# EasyEDA Pro project ProPrj_Bed Temp Regulation_2026-02-19.epro

# Schematic Schematic Main

## Sheets
1 ADC & ESP: Board Name: Main Board; Create Date: 2026-02-11; Page Name: ADC & ESP; Project Name: Bed Temp Regulation; Schematic Name: Schematic Main; Update Date: 2026-02-17; Company: EasyEDA.com; Page Size: A4; Version: V1.0
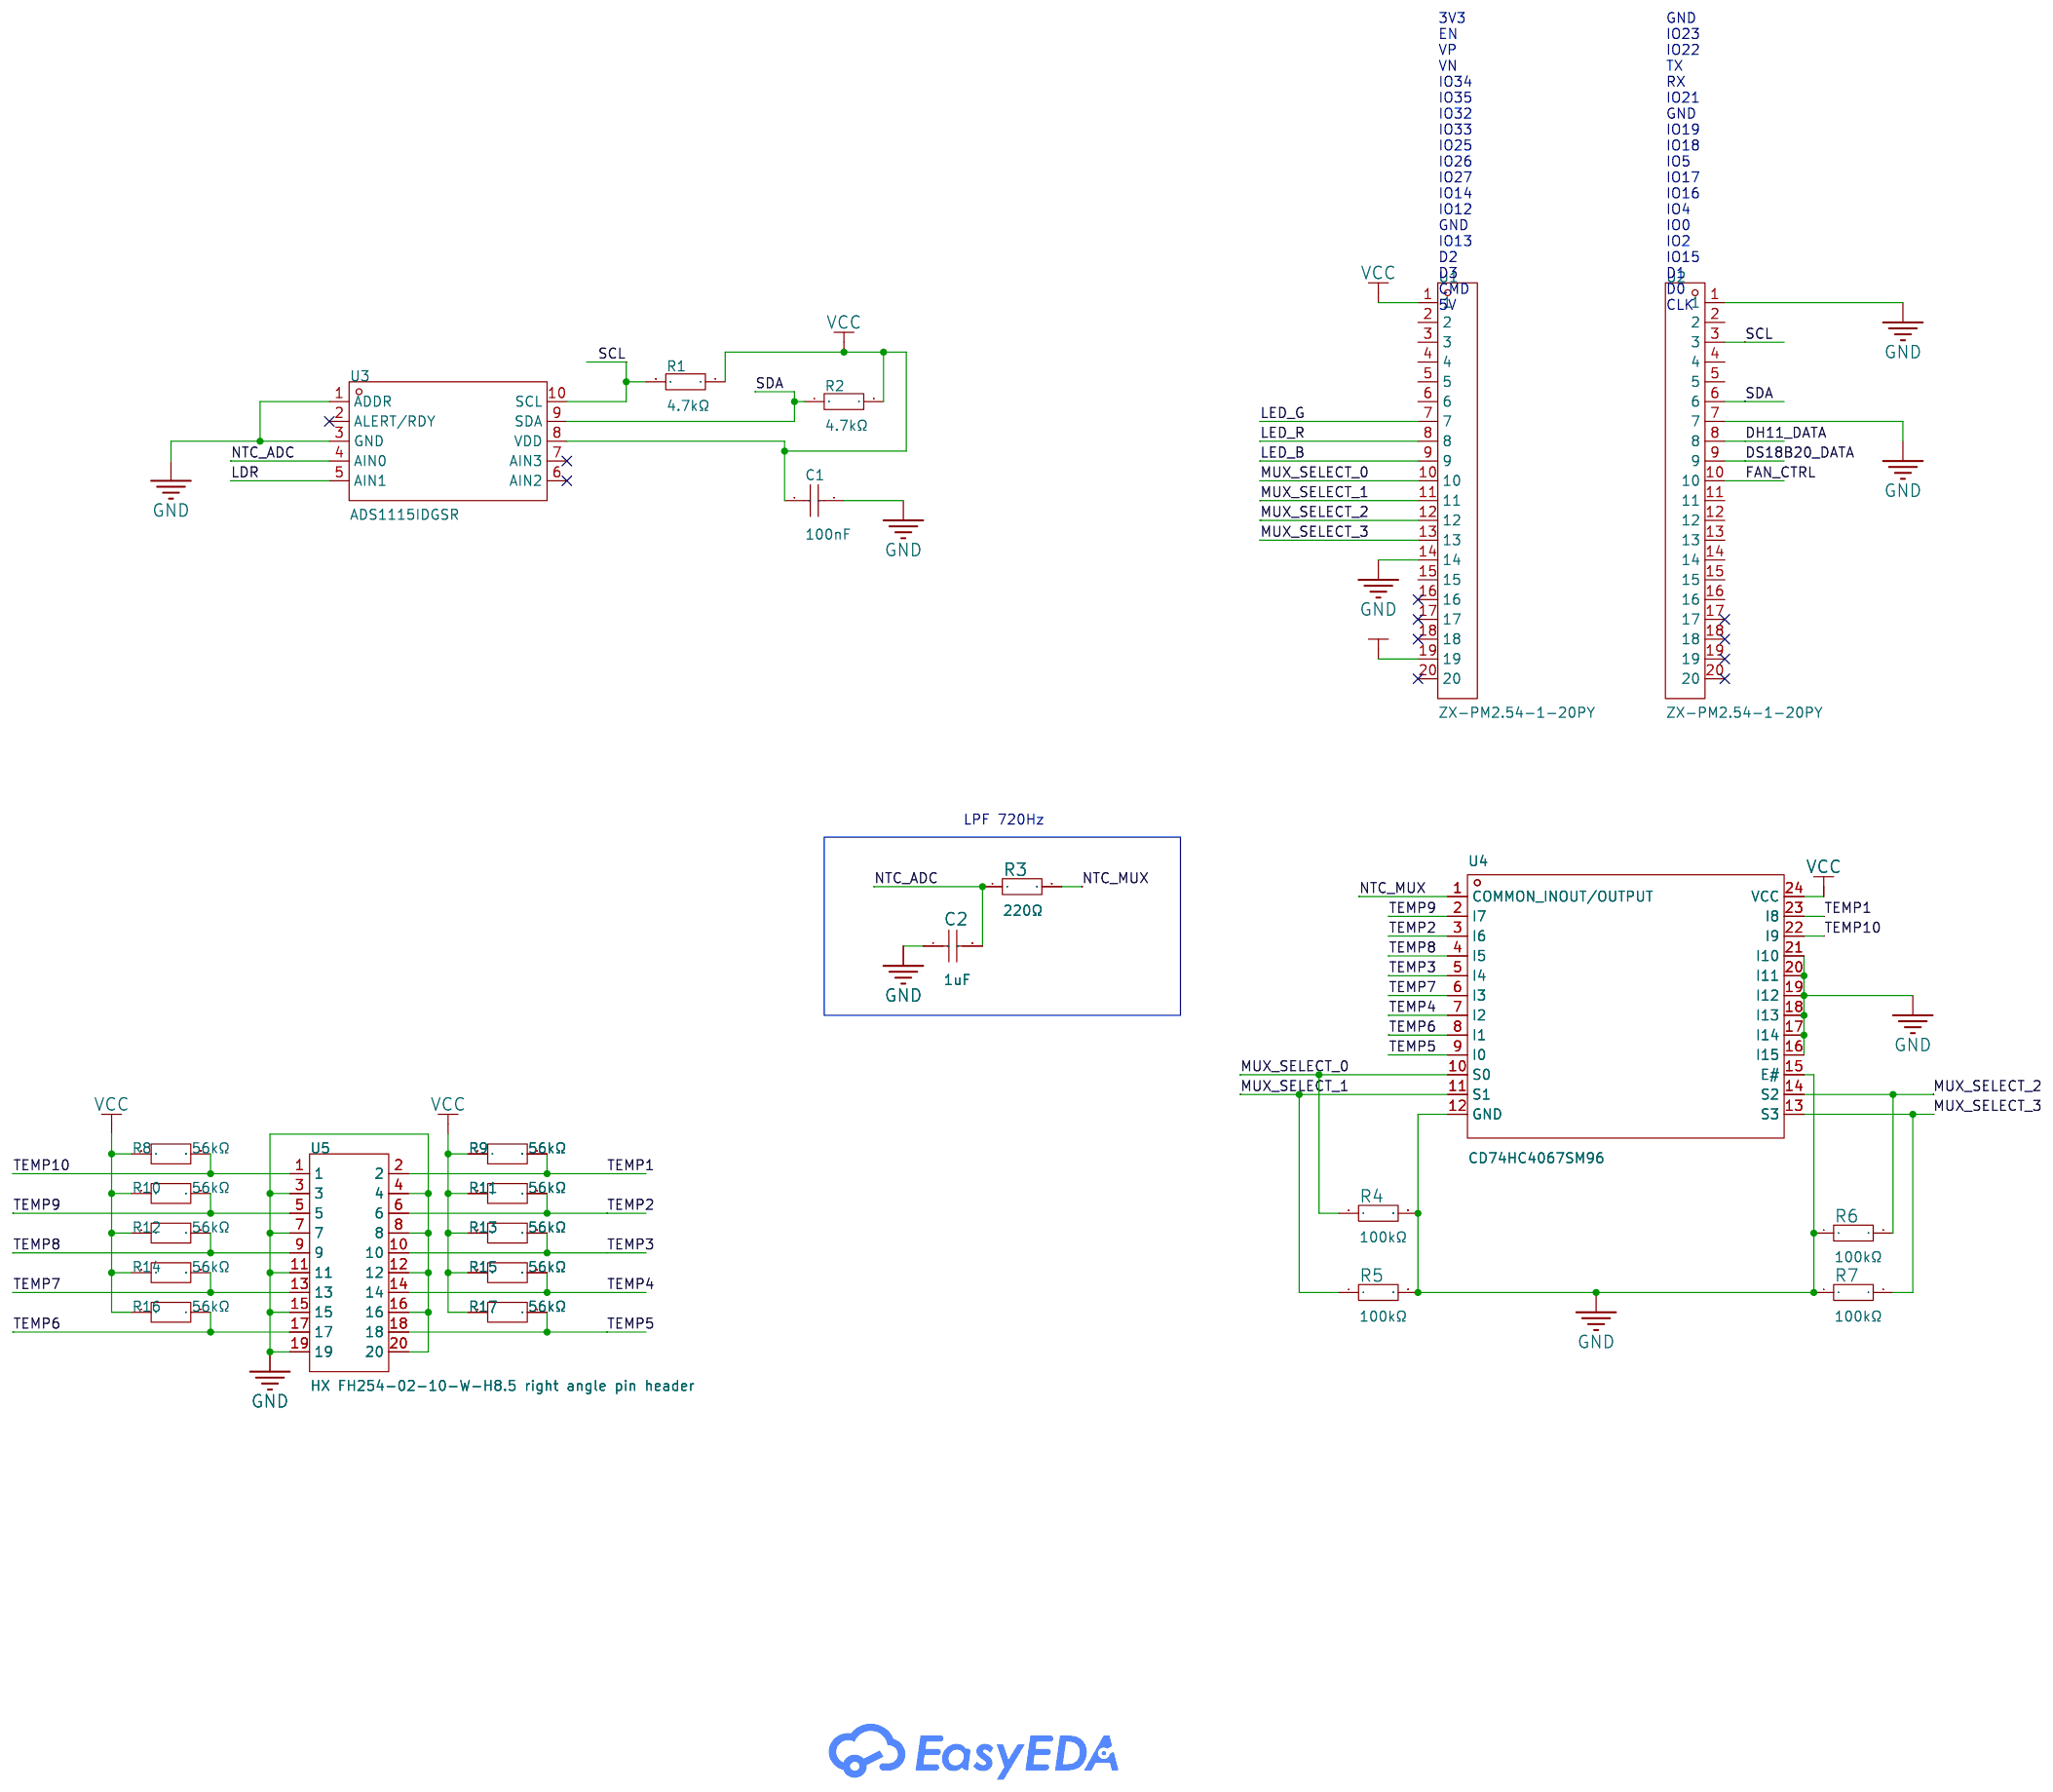
[diagram p0: ADC & ESP]
2 FAN: Create Date: 2026-02-16; Page Name: FAN
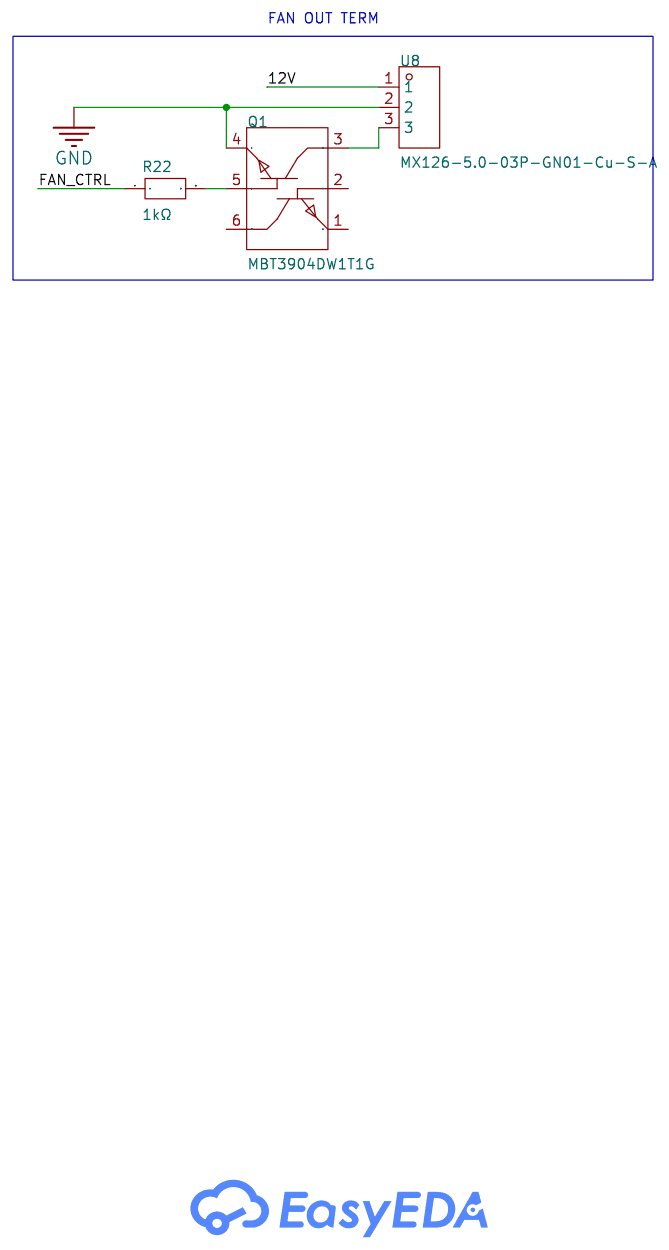
[diagram p1: FAN]
3 PWR: Create Date: 2026-02-16; Page Name: PWR
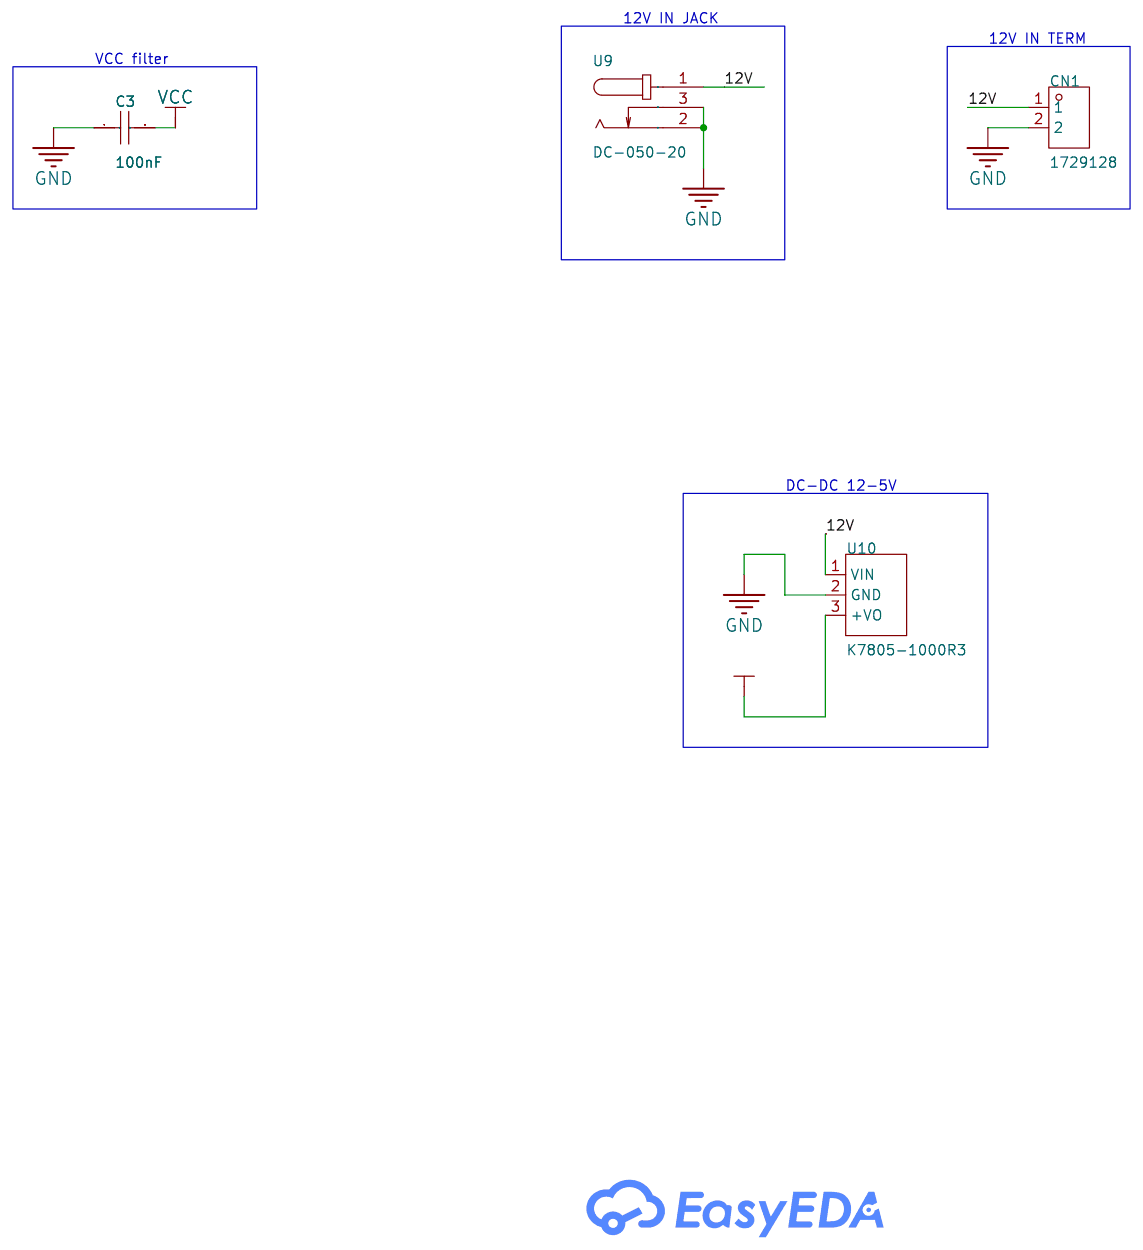
[diagram p2: PWR]
4 LED & ENV: Create Date: 2026-02-16; Page Name: LED & ENV
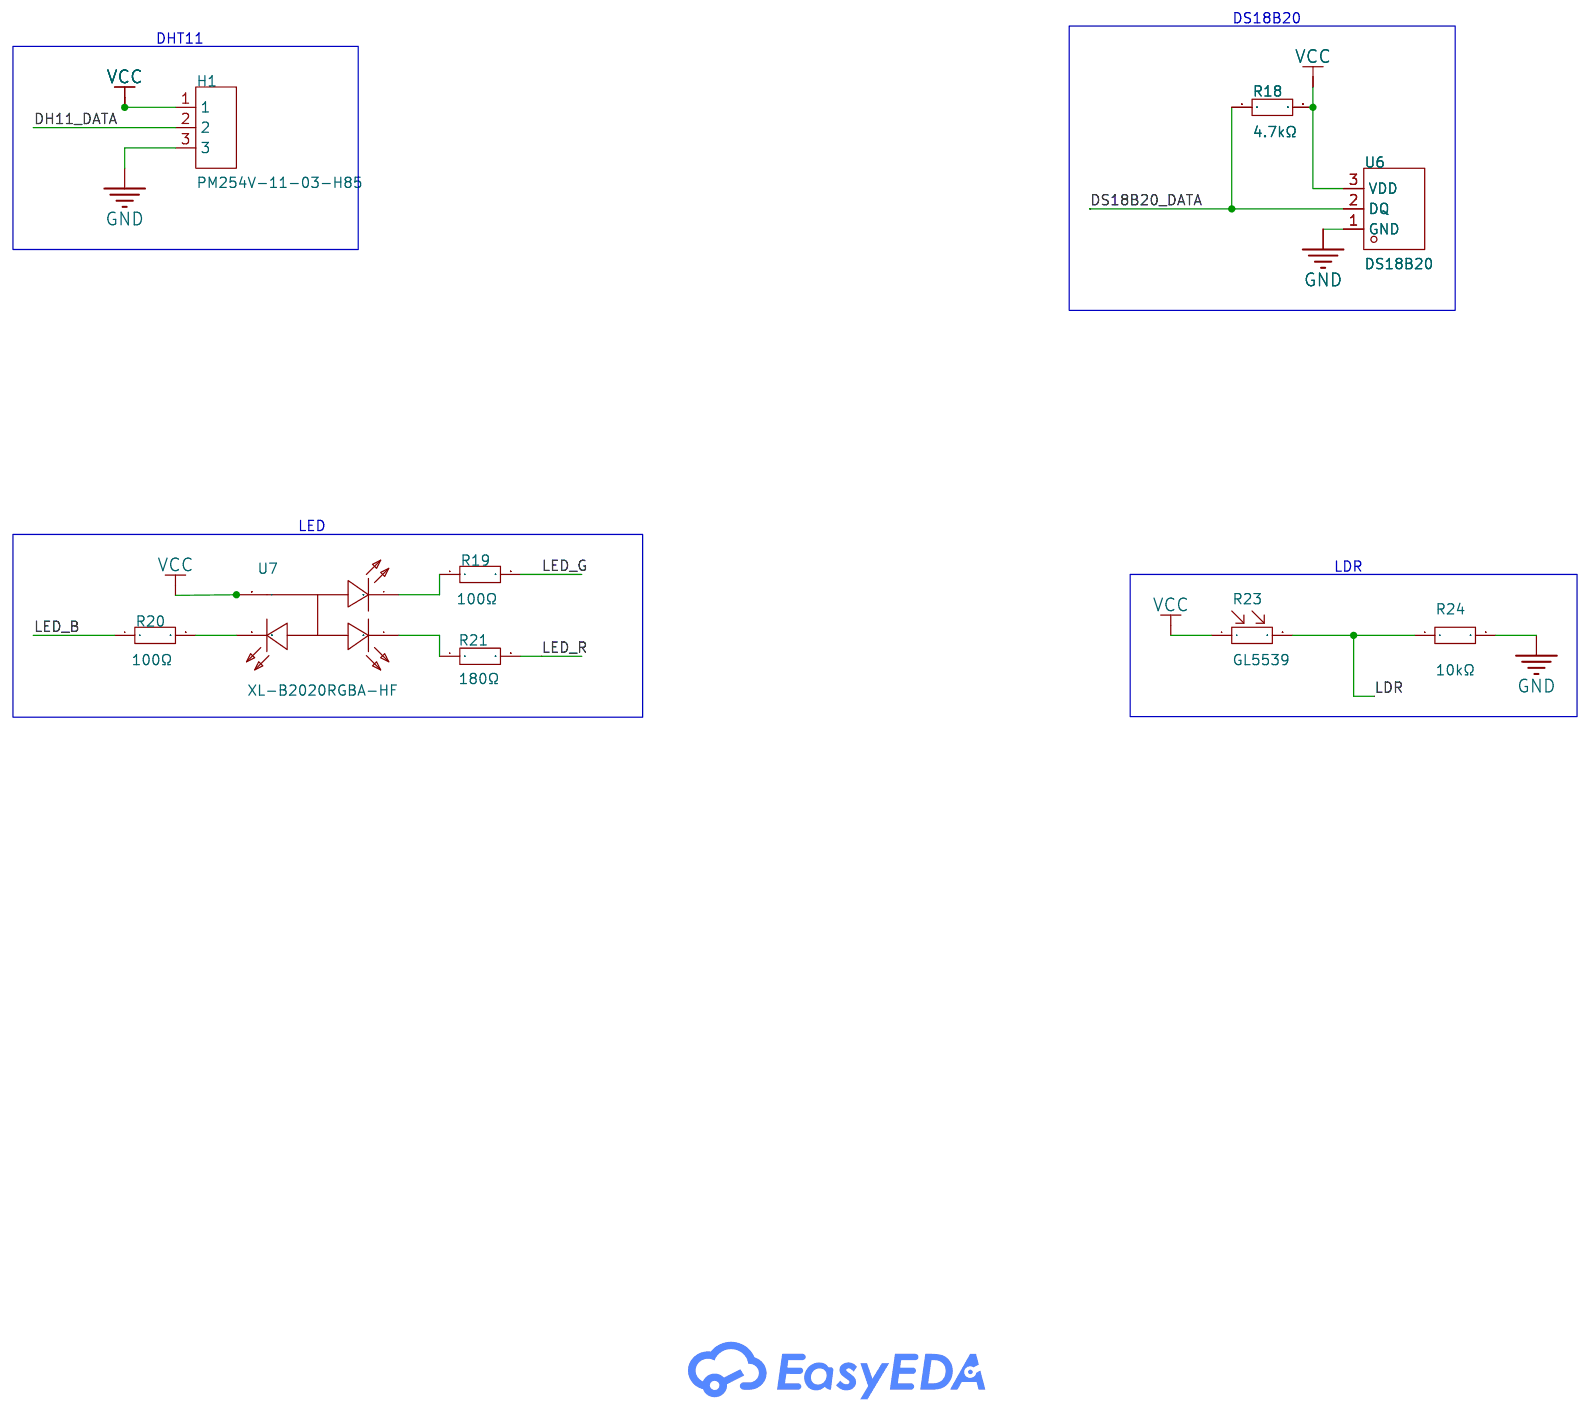
[diagram p3: LED & ENV]

## Parts
sheet ADC & ESP
C1  100nF  [C0805]
C2  1uF  [C0805]
R1  4.7kΩ  [R0805]
R2  4.7kΩ  [R0805]
R3  220Ω  [R0805]
R4  100kΩ  [R0805]
R5  100kΩ  [R0805]
R6  100kΩ  [R0805]
R7  100kΩ  [R0805]
R8  56kΩ  [R0805]
R9  56kΩ  [R0805]
R10  56kΩ  [R0805]
R11  56kΩ  [R0805]
R12  56kΩ  [R0805]
R13  56kΩ  [R0805]
R14  56kΩ  [R0805]
R15  56kΩ  [R0805]
R16  56kΩ  [R0805]
R17  56kΩ  [R0805]
U1  ZX-PM2.54-1-20PY  [HDR-TH_20P-P2.54-V-F]
U2  ZX-PM2.54-1-20PY  [HDR-TH_20P-P2.54-V-F]
U3  ADS1115IDGSR  [MSOP-10_L3.0-W3.0-P0.50-LS5.0-BL]
U4  CD74HC4067SM96  [SSOP-24_L8.1-W5.3-P0.65-LS7.8-BL]
U5  HX FH254-02-10-W-H8.5 right angle pin header  [HDR-TH_20P-P2.54-H-F-R2-C10-S2.54-W12.7]
sheet FAN
Q1  MBT3904DW1T1G  [SOT-363_L2.0-W1.3-P0.65-LS2.1-TL]
R22  1kΩ  [R0805]
U8  MX126-5.0-03P-GN01-Cu-S-A  [CONN-TH_3P-P5.00_MAX_MX126-5.0-GN01-03P-CU-S-A]
sheet LED & ENV
H1  PM254V-11-03-H85  [HDR-TH_3P-P2.54-V-F]
R18  4.7kΩ  [R0805]
R19  100Ω  [R0805]
R20  100Ω  [R0805]
R21  180Ω  [R0805]
R23  GL5539  [RES-TH_L5.1-W4.3-P3.40-D0.5]  (no BOM)
R24  10kΩ  [R0805]
U6  DS18B20  [TO-92-3_L4.5-W3.5-P1.27-L]  (no BOM)
U7  XL-B2020RGBA-HF  [LED-SMD_4P-L2.1-W2.1-P1.0-BL]
sheet PWR
C3  100nF  [C0805]
CN1  1729128  [CONN-TH_2P-P5.08_1729128]
U9  DC-050-20  [DC-IN-SMD_DC-050-20A]
U10  K7805-1000R3  [PWRM-TH_YLPTEC_K78XX-1000R3]

## Library data of the parts
C1 C3 = CL21B104KCFNNNE: Capacitance:100nF Tolerance:±10% Tolerance:±10% Voltage Rating:100V Temperature Coefficient:X7R; LCSC Part Name: 100nF ±10% 100V; Supplier Part: C28233; Manufacturer: SAMSUNG(三星); Supplier Footprint: 0805; JLCPCB Part Class: Basic Part; Datasheet: https://item.szlcsc.com/datasheet/CL21B104KCFNNNE/28983.html; Supplier: LCSC; Tolerance: ±10%; Voltage Rating: 100V; Temperature Coefficient: X7R
C2 = CL21B105KBFNNNE: Capacitance:1uF Tolerance:±10% Tolerance:±10% Voltage Rating:50V Temperature Coefficient:X7R; LCSC Part Name: 1uF ±10% 50V; Supplier Part: C28323; Manufacturer: SAMSUNG(三星); Supplier Footprint: 0805; JLCPCB Part Class: Basic Part; Datasheet: https://item.szlcsc.com/datasheet/CL21B105KBFNNNE/29074.html; Supplier: LCSC; Tolerance: ±10%; Voltage Rating: 50V; Temperature Coefficient: X7R
R1 R2 R18 = 0805W8F4701T5E: Type:Thick Film Resistors Resistance:4.7kΩ Tolerance:±1% Tolerance:±1% Power(Watts): Overload Voltage (Max): Temperature Coefficient:±100ppm/℃ Temperature Coefficient:±100ppm/℃ Operating Temperature Range:-55℃~+155℃ Operating Temperature Range:-55℃~+155℃; LCSC Part Name: 4.7kΩ ±1% 125mW 厚膜电阻; Supplier Part: C17673; Manufacturer: UNI-ROYAL(厚声); Supplier Footprint: 0805; JLCPCB Part Class: Basic Part; Datasheet: https://atta.szlcsc.com/upload/public/pdf/source/20200306/C422600_1E6D84923E4A46A82E41ADD87F860B5C.pdf; Supplier: LCSC; Type: Thick Film Resistors; Tolerance: ±1%; Temperature Coefficient: ±100ppm/℃; Operating Temperature Range: -55℃~+155℃
R3 = 0805W8F2200T5E: Type:Thick Film Resistor Resistance:220Ω Tolerance:±1% Tolerance:±1% Power(Watts):125mW Voltage-Supply(Max):150V Temperature Coefficient:±100ppm/℃ Temperature Coefficient:±100ppm/℃ Operating Temperature:-55℃~+155℃ Operating Temperature:-55℃~+155℃; LCSC Part Name: 220Ω ±1% 125mW 厚膜电阻; Supplier Part: C17557; Manufacturer: UNI-ROYAL(厚声); Supplier Footprint: 0805; JLCPCB Part Class: Basic Part; Datasheet: https://item.szlcsc.com/datasheet/0805W8F2200T5E/18245.html; Supplier: LCSC; Type: Thick Film Resistor; Tolerance: ±1%; Power(Watts): 125mW; Voltage-Supply(Max): 150V; Temperature Coefficient: ±100ppm/℃; Operating Temperature: -55℃~+155℃
R4-R7 = 0805W8F1003T5E: Type:Thick Film Resistor Resistance:100kΩ Tolerance:±1% Tolerance:±1% Power(Watts):125mW Voltage-Supply(Max):150V Temperature Coefficient:±100ppm/℃ Temperature Coefficient:±100ppm/℃ Operating Temperature:-55℃~+155℃ Operating Temperature:-55℃~+155℃; LCSC Part Name: 100kΩ ±1% 125mW 厚膜电阻; Supplier Part: C149504; Manufacturer: UNI-ROYAL(厚声); Supplier Footprint: 0805; JLCPCB Part Class: Basic Part; Datasheet: https://item.szlcsc.com/datasheet/0805W8F1003T5E/160838.html; Supplier: LCSC; Type: Thick Film Resistor; Tolerance: ±1%; Power(Watts): 125mW; Voltage-Supply(Max): 150V; Temperature Coefficient: ±100ppm/℃; Operating Temperature: -55℃~+155℃
R8-R17 = TC0525B5602T5G: Type:Thin Film Resistor Resistance:56kΩ Tolerance:±0.1% Tolerance:±0.1% Power(Watts):125mW Voltage-Supply(Max):150V Temperature Coefficient:±25ppm/℃ Temperature Coefficient:±25ppm/℃ Operating Temperature:-55℃~+155℃ Operating Temperature:-55℃~+155℃; LCSC Part Name: 薄膜电阻 56kΩ ±0.1% 125mW; Supplier Part: C21571499; Manufacturer: UNI-ROYAL(厚声); Supplier Footprint: 0805; JLCPCB Part Class: Extended Part; Datasheet: https://item.szlcsc.com/datasheet/TC0525B5602T5G/22998160.html; Supplier: LCSC; Type: Thin Film Resistor; Tolerance: ±0.1%; Power(Watts): 125mW; Voltage-Supply(Max): 150V; Temperature Coefficient: ±25ppm/℃; Operating Temperature: -55℃~+155℃
U1 U2 = ZX-PM2.54-1-20PY: Holes Structure:1x20P Pitch:2.54mm Row Spacing:- Circular Hole / Square Hole:Square Hole Mounting Type:Through Hole Number of Rows:1 Number of Positions:20P Current Rating:3A Voltage Rating (Max):- Holes Direction:Top Insulation Height:8.5mm Contact Mater; LCSC Part Name: 1x20P 间距:2.54mm 直插; Supplier Part: C7499336; Manufacturer: Megastar(兆星); Supplier Footprint: 插件,P=2.54mm; JLCPCB Part Class: Extended Part; Datasheet: https://item.szlcsc.com/datasheet/ZX-PM2.54-1-20PY/8573997.html; Supplier: LCSC; Holes Structure: 1x20P; Pitch: 2.54mm; Circular Hole / Square Hole: Square Hole; Mounting Type: Through Hole; Number of Rows: 1; Number of Positions: 20P; Current Rating: 3A; Holes Direction: Top; Insulation Height: 8.5mm; Contact Material: Brass; Contact Plating: Gold; Operating Temperature: -40℃~+105℃; PIN Length: 3.2mm
U3 = ADS1115IDGSR: Resolution(Bits):16 Sampling Rate:- number of channels:2 Voltage - Supply:2V~5.5V Voltage - Supply:2V~5.5V Interface:I2C differential input:Yes Integral non - linearity:1LSB Integral non - linearity:1LSB Operating Temperature:-40℃~+125℃ Operating Temperat; LCSC Part Name: 具有内部基准、振荡器和可编程比较器且兼容 I2C 的ADS111x、超小型、低功耗 860SPS、16位ADC; Supplier Part: C37593; Manufacturer: TI(德州仪器); Supplier Footprint: VSSOP-10; JLCPCB Part Class: Extended Part; Datasheet: https://www.ti.com/cn/lit/gpn/ads1115; Supplier: LCSC; Resolution(Bits): 16; number of channels: 2; Voltage - Supply: 2V~5.5V; Interface: I2C; differential input: Yes; Integral non - linearity: 1LSB; Operating Temperature: -40℃~+125℃; Clock/Oscillator: Built-in; Voltage Reference: Built-in; Programmable Gain: Support; ADC architecture: Sigma-Delta; Data rate: 128Hz；8Hz；64Hz；16Hz；32Hz；250Hz；475Hz；860Hz; Quiescent Current (Iq): 500nA; Full-Scale Range(FSR): 2.048V
U4 = CD74HC4067SM96: Switch Circuit:16:1 Number of Channels:16 Voltage - Supply:2V~6V Voltage - Supply:2V~6V Turn-on time:- Ron:70Ω Turn-off time:- Operating Temperature:-55℃~+125℃ Operating Temperature:-55℃~+125℃ Con:5pF Bandwidth:89MHz Propagation Delay (tpd):15ns; LCSC Part Name: 高速CMOS逻辑16通道模拟多路复用器/解复用器; Supplier Part: C98457; Manufacturer: TI(德州仪器); Supplier Footprint: SSOP-24-208mil; JLCPCB Part Class: Extended Part; Datasheet: https://www.ti.com/cn/lit/gpn/cd74hc4067; Supplier: LCSC; Switch Circuit: 16:1; Number of Channels: 16; Voltage - Supply: 2V~6V; Ron: 70Ω; Operating Temperature: -55℃~+125℃; Con: 5pF; Bandwidth: 89MHz; Propagation Delay (tpd): 15ns
U5 = HX FH254-02-10-W-H8.5 right angle pin header: Holes Structure:2x10P Pitch:2.54mm Row Spacing:2.54mm Circular Hole / Square Hole:Square Hole Mounting Type:Right Angle Number of Rows:2 Number of Positions:20P Current Rating:3A Voltage Rating (Max):1kV Holes Direction:Side Insulation Height:8.5mm Contac; LCSC Part Name: 2x10P 间距:2.54mm 弯插; Supplier Part: C52016398; Manufacturer: hanxia(韩下); Supplier Footprint: 弯插,P=2.54mm; JLCPCB Part Class: Extended Part; Datasheet: https://item.szlcsc.com/datasheet/HX%2520FH254-02-10-W-H8.5%2520right%2520angle%2520pin%2520header/54760443.html; Supplier: LCSC; Holes Structure: 2x10P; Pitch: 2.54mm; Row Spacing: 2.54mm; Circular Hole / Square Hole: Square Hole; Mounting Type: Right Angle; Number of Rows: 2; Number of Positions: 20P; Current Rating: 3A; Voltage Rating (Max): 1kV; Holes Direction: Side; Insulation Height: 8.5mm; Contact Material: Brass; Contact Plating: Gold; Operating Temperature: -40℃~+105℃; PIN Length: 3.2mm
Q1 = MBT3904DW1T1G: type:NPN Current - Collector(Ic):200mA Collector - Emitter Voltage VCEO:40V Pd - Power Dissipation:150mW DC Current Gain:100@10mA,1.0V DC Current Gain:100@10mA,1.0V Transition frequency(fT):300MHz Current - Collector Cutoff:50nA Vce Saturation(VCE(sat)):3; LCSC Part Name: NPN 电流:200mA 电压:40V; Supplier Part: C110150; Manufacturer: onsemi(安森美); Supplier Footprint: SOT-363; JLCPCB Part Class: Extended Part; Datasheet: https://item.szlcsc.com/datasheet/MBT3904DW1T1G/111371.html; Supplier: LCSC; type: NPN; Current - Collector(Ic): 200mA; Collector - Emitter Voltage VCEO: 40V; Pd - Power Dissipation: 150mW; DC Current Gain: 100@10mA,1.0V; Transition frequency(fT): 300MHz; Current - Collector Cutoff: 50nA; Vce Saturation(VCE(sat)): 300mV@50mA,5mA; Operating Temperature: -55℃~+150℃; Emitter-Base Voltage(Vebo): 6V
R22 = FRC0805J102 TS: Type:Thick Film Resistor Resistance:1kΩ Tolerance:±5% Tolerance:±5% Power(Watts):125mW Voltage-Supply(Max):150V Temperature Coefficient:±100ppm/℃ Temperature Coefficient:±100ppm/℃ Operating Temperature:-55℃~+155℃ Operating Temperature:-55℃~+155℃; LCSC Part Name: 1kΩ ±5% 125mW 厚膜电阻; Supplier Part: C2907295; Manufacturer: FOJAN(富捷); Supplier Footprint: 0805; JLCPCB Part Class: Extended Part; Supplier: LCSC; Type: Thick Film Resistor; Tolerance: ±5%; Power(Watts): 125mW; Voltage-Supply(Max): 150V; Temperature Coefficient: ±100ppm/℃; Operating Temperature: -55℃~+155℃
U8 = MX126-5.0-03P-GN01-Cu-S-A: Number of Positions or Pins:1x3P Pitch:5mm Color:Green Mounting Type:Through Hole Number of Pins:3P Number of Rows:1 Number of PINs Per Row:3 Screw Specification:M2.5 Current Rating:10A Voltage Rating (Max):300V Wire Gauge - AWG:14~26 Wire Gauge - mm2:2.5; LCSC Part Name: 1x3P 5mm 直插 排数:1 每排P数:3; Supplier Part: C5188435; Manufacturer: MAX(迈旭); Supplier Footprint: 插件,P=5mm; JLCPCB Part Class: Extended Part; Datasheet: https://item.szlcsc.com/datasheet/MX126-5.0-03P-GN01-Cu-S-A/5862519.html; Supplier: LCSC; Number of Positions or Pins: 1x3P; Pitch: 5mm; Color: Green; Mounting Type: Through Hole; Number of Pins: 3P; Number of Rows: 1; Number of PINs Per Row: 3; Screw Specification: M2.5; Current Rating: 10A; Voltage Rating (Max): 300V; Wire Gauge - AWG: 14~26; Wire Gauge - mm2: 2.5; Operating Temperature: -40℃~+105℃
H1 = PM254V-11-03-H85: Holes Structure:1x3P Pitch:2.54mm Row Spacing:- Circular Hole / Square Hole:Square Hole Mounting Type:Through Hole Number of Rows:1 Number of Positions:3P Current Rating:3A Holes Direction:Top Insulation Height:8.5mm Contact Material:Brass Contact Plating; LCSC Part Name: 1x3P 间距:2.54mm 直插; Supplier Part: C541850; Manufacturer: XFCN(兴飞); Supplier Footprint: 插件,P=2.54mm; JLCPCB Part Class: Extended Part; Datasheet: https://item.szlcsc.com/datasheet/PM254V-11-03-H85/562471.html; Supplier: LCSC; Holes Structure: 1x3P; Pitch: 2.54mm; Circular Hole / Square Hole: Square Hole; Mounting Type: Through Hole; Number of Rows: 1; Number of Positions: 3P; Current Rating: 3A; Holes Direction: Top; Insulation Height: 8.5mm; Contact Material: Brass; Operating Temperature: -40℃~+105℃
R19 R20 = 0805W8F1000T5E_C17408: Type:Thick Film Resistors Resistance: Tolerance:±1% Tolerance:±1% Power(Watts): Overload Voltage (Max): Temperature Coefficient:±100ppm/℃ Temperature Coefficient:±100ppm/℃ Operating Temperature Range:-55℃~+155℃ Operating Temperature Range:-55℃~+155℃; LCSC Part Name: 100Ω ±1% 125mW 厚膜电阻; Supplier Part: C17408; Manufacturer: UNI-ROYAL(厚声); Manufacturer Part: 0805W8F1000T5E; Supplier Footprint: 0805; JLCPCB Part Class: Basic Part; Datasheet: https://atta.szlcsc.com/upload/public/pdf/source/20200306/C422600_1E6D84923E4A46A82E41ADD87F860B5C.pdf; Supplier: LCSC; Type: Thick Film Resistors; Tolerance: ±1%; Temperature Coefficient: ±100ppm/℃; Operating Temperature Range: -55℃~+155℃
R21 = 0805W8F1800T5E: Type:Thick Film Resistor Resistance:180Ω Tolerance:±1% Tolerance:±1% Power(Watts):125mW Voltage-Supply(Max):150V Temperature Coefficient:±100ppm/℃ Temperature Coefficient:±100ppm/℃ Operating Temperature:-55℃~+155℃ Operating Temperature:-55℃~+155℃; LCSC Part Name: 180Ω ±1% 125mW 厚膜电阻; Supplier Part: C25270; Manufacturer: UNI-ROYAL(厚声); Supplier Footprint: 0805; JLCPCB Part Class: Extended Part; Datasheet: https://item.szlcsc.com/datasheet/0805W8F1800T5E/26013.html; Supplier: LCSC; Type: Thick Film Resistor; Tolerance: ±1%; Power(Watts): 125mW; Voltage-Supply(Max): 150V; Temperature Coefficient: ±100ppm/℃; Operating Temperature: -55℃~+155℃
R23 = GL5539: Dark Resistance:10MΩ Cell Resistance @ Illuminance:50kΩ~100kΩ Cell Resistance @ Illuminance:50kΩ~100kΩ Voltage - Max:150V Wavelength - Peak:540nm Rise Time:20ms Fall Time:30ms Operating Temperature:-30℃~+70℃ Operating Temperature:-30℃~+70℃ γ Value:0.8; Supplier Part: C125630; Manufacturer: 森霸; Supplier Footprint: 插件,P=3mm; JLCPCB Part Class: Extended Part; Datasheet: https://item.szlcsc.com/datasheet/GL5539/136908.html; Supplier: LCSC; Dark Resistance: 10MΩ; Cell Resistance @ Illuminance: 50kΩ~100kΩ; Voltage - Max: 150V; Wavelength - Peak: 540nm; Rise Time: 20ms; Fall Time: 30ms; Operating Temperature: -30℃~+70℃; γ Value: 0.8
R24 = 0805W8F1002T5E: Type:Thick Film Resistor Resistance:10kΩ Tolerance:±1% Tolerance:±1% Power(Watts):125mW Voltage-Supply(Max):150V Temperature Coefficient:±100ppm/℃ Temperature Coefficient:±100ppm/℃ Operating Temperature:-55℃~+155℃ Operating Temperature:-55℃~+155℃; LCSC Part Name: 10kΩ ±1% 125mW 厚膜电阻; Supplier Part: C17414; Manufacturer: UNI-ROYAL(厚声); Supplier Footprint: 0805; JLCPCB Part Class: Basic Part; Datasheet: https://item.szlcsc.com/datasheet/0805W8F1002T5E/18102.html; Supplier: LCSC; Type: Thick Film Resistor; Tolerance: ±1%; Power(Watts): 125mW; Voltage-Supply(Max): 150V; Temperature Coefficient: ±100ppm/℃; Operating Temperature: -55℃~+155℃
U6 = DS18B20: Temperature Range:- Temperature Range:- Tolerance:±0.4℃ Tolerance:±0.4℃ Voltage - Supply:2.5V~5.5V Voltage - Supply:2.5V~5.5V Standby Current:- Interface:- Temperature Conversion Time:- Temperature Resolution:-; LCSC Part Name: 温度-10℃~70℃ 精度±0.4℃ 电压2.5V~5.5V; Supplier Part: C5451632; Manufacturer: HXY MOSFET(华轩阳电子); Supplier Footprint: TO-92; JLCPCB Part Class: Extended Part; Datasheet: https://item.szlcsc.com/datasheet/DS18B20/6355375.html; Supplier: LCSC; Tolerance: ±0.4℃; Voltage - Supply: 2.5V~5.5V
U7 = XL-B2020RGBA-HF: Diode Configuration:Common Anode Wavelength - Dominant:B:460nm~470nm；G:520nm~530nm；R:620nm~630nm Peak Wavelength:G:520nm；R:625nm；B:465nm Luminous Intensity:G:240mcd~780mcd；R:55mcd~280mcd；B:75mcd~380mcd Viewing Angle:120° Forward Current:R:20mA；B:20mA；G:20; LCSC Part Name: 发光二极管 高亮度七彩 封装：2020黑色哑光 功率 50mW；70mW；70mW 正向电流 20mA 主波长 620nm~630nm；520~530nm；460~470nm 峰值波长 625nm; 520nm; 465nm 工作温度 -20℃~+85℃; Supplier Part: C22461782; Manufacturer: XINGLIGHT(成兴光); Supplier Footprint: SMD-4P,2.1x2.1mm; JLCPCB Part Class: Extended Part; Datasheet: https://item.szlcsc.com/datasheet/XL-B2020RGBA-HF/24144332.html; Supplier: LCSC; Diode Configuration: Common Anode; Wavelength - Dominant: B:460nm~470nm；G:520nm~530nm；R:620nm~630nm; Peak Wavelength: G:520nm；R:625nm；B:465nm; Luminous Intensity: G:240mcd~780mcd；R:55mcd~280mcd；B:75mcd~380mcd; Viewing Angle: 120°; Forward Current: R:20mA；B:20mA；G:20mA; Forward Voltage(Vf): G:2.6V~3.2V；R:1.9V~2.3V；B:2.6V~3.2V; Antistatic Capacity: B:2000V；R:2000V；G:2000V; Power(Watts): G:70mW；B:70mW；R:50mW; Operating Temperature: -20℃~+85℃; Length: 2.1mm; Width: 2.1mm; Height: 1mm
CN1 = 1729128_C7509570: LCSC Part Name: 可拼接 1729128; Supplier Part: C7509570; Manufacturer: Phoenix Contact(菲尼克斯); Supplier Footprint: 插件,P=5.08mm; JLCPCB Part Class: Extended Part; Datasheet: https://item.szlcsc.com/datasheet/1729128/8618709.html; Supplier: LCSC
U9 = DC-050-20: Connector Type:DC Power Jack Mounting Type:Surface Mount, Right Angle Inside Contact Diameter:2mm Outside Contact Diameter:6mm; LCSC Part Name: DC电源插座 内径:2mm 外径:6mm; Supplier Part: C22435680; Manufacturer: HanElectricity(瀚源); Supplier Footprint: SMD; JLCPCB Part Class: Extended Part; Datasheet: https://item.szlcsc.com/datasheet/DC-050-20/24065954.html; Supplier: LCSC; Connector Type: DC Power Jack; Mounting Type: Surface Mount, Right Angle; Inside Contact Diameter: 2mm; Outside Contact Diameter: 6mm
U10 = K7805-1000R3: Function:Buck-Boost Number of Outputs:1 Voltage - Supply:8V~36V Voltage - Supply:8V~36V Output Voltage Accuracy:±3% Output Voltage Accuracy:±3% Output Voltage:5V Output Voltage:5V Output Current(Max):1A Output Current(Max):1A Output Power:- Conversion Eff; LCSC Part Name: DC/DC电源模块-非隔离; Supplier Part: C2992391; Manufacturer: YLPTEC(易川); Supplier Footprint: DIP,11.5x7.6mm; JLCPCB Part Class: Extended Part; Datasheet: https://item.szlcsc.com/datasheet/K7805-1000R3/3456894.html; Supplier: LCSC; Function: Buck-Boost; Number of Outputs: 1; Voltage - Supply: 8V~36V; Output Voltage Accuracy: ±3%; Output Voltage: 5V; Output Current(Max): 1A; Conversion Efficiency: 93%; Capacitive Load(Max): 680uF; Supply Current (Iq): 1mA; Switching Frequency: 500kHz; Ripple Noise: 60mVp-p; Features: Short Circuit Protection; Length: 11.5mm; Width: 7.55mm; Height: 10.2mm; Operating Temperature Range: -40℃~+85℃

## Nets
5V: U1.19 U10.3(+VO)
12V: CN1.1 U8.1 U9.1 U10.1(VIN)
GND: C1.1 C2.1 C3.1 CN1.2 H1.3 Q1.4 R4.2 R5.2 R6.1 R7.1 R24.2 U1.14 U2.1 U2.7 U3.1(ADDR) U3.3(GND) U4.12(GND) U4.15(E#) U4.16(I15) U4.17(I14) U4.18(I13) U4.19(I12) U4.20(I11) U4.21(I10) U5.3 U5.4 U5.7 U5.8 U5.11 U5.12 U5.15 U5.16 U5.19 U5.20 U6.1(GND) U8.2 U9.2 U9.3 U10.2(GND)
VCC: C1.2 C3.2 H1.1 R1.1 R2.2 R8.1 R9.1 R10.1 R11.1 R12.1 R13.1 R14.1 R15.1 R16.1 R17.1 R18.2 R23.1 U1.1 U3.8(VDD) U4.24(VCC) U6.3(VDD) U7.3(A)
DH11_DATA: H1.2 U2.8
DS18B20_DATA: R18.1 U2.9 U6.2(DQ)
FAN_CTRL: R22.1 U2.10
LDR: R23.2 R24.1 U3.5(AIN1)
LED_B: R20.1 U1.9
LED_G: R19.2 U1.7
LED_R: R21.2 U1.8
MUX_SELECT_0: R4.1 U1.10 U4.10(S0)
MUX_SELECT_1: R5.1 U1.11 U4.11(S1)
MUX_SELECT_2: R6.2 U1.12 U4.14(S2)
MUX_SELECT_3: R7.2 U1.13 U4.13(S3)
NTC_ADC: C2.2 R3.1 U3.4(AIN0)
NTC_MUX: R3.2 U4.1(COMMON INOUT/OUTPUT)
SCL: R1.2 U2.3 U3.10(SCL)
SDA: R2.1 U2.6 U3.9(SDA)
TEMP1: R9.2 U4.23(I8) U5.2
TEMP2: R11.2 U4.3(I6) U5.6
TEMP3: R13.2 U4.5(I4) U5.10
TEMP4: R15.2 U4.7(I2) U5.14
TEMP5: R17.2 U4.9(I0) U5.18
TEMP6: R16.2 U4.8(I1) U5.17
TEMP7: R14.2 U4.6(I3) U5.13
TEMP8: R12.2 U4.4(I5) U5.9
TEMP9: R10.2 U4.2(I7) U5.5
TEMP10: R8.2 U4.22(I9) U5.1
$3N394: Q1.3 U8.3
$3N812: Q1.5 R22.2
$6N1989: R19.1 U7.4(C)
$6N2479: R21.1 U7.1(C)
$6N2851: R20.2 U7.2(C)

Not connected (* = marked no-connect by the designer): Q1 1 2 6; U1 2 3 4 5 6 15 16* 17* 18* 20*; U2 2 4 5 11 12 13 14 15 16 17* 18* 19* 20*; U3 2(ALERT/RDY)* 6(AIN2)* 7(AIN3)*

## Notes on the sheets
sheet 1
- 3V3
  EN
  VP
  VN
  IO34
  IO35
  IO32
  IO33
  IO25
  IO26
  IO27
  IO14
  IO12
  GND
  IO13
  D2
  D3
  CMD
  5V
- GND
  IO23
  IO22
  TX
  RX
  IO21
  GND
  IO19
  IO18
  IO5
  IO17
  IO16
  IO4
  IO0
  IO2
  IO15
  D1
  D0
  CLK
- LPF 720Hz
sheet 2
- FAN OUT TERM
sheet 3
- 12V IN JACK
- 12V IN TERM
- VCC filter
- DC-DC 12-5V
sheet 4
- DS18B20
- DHT11
- LED
- LDR

# Board PCB1
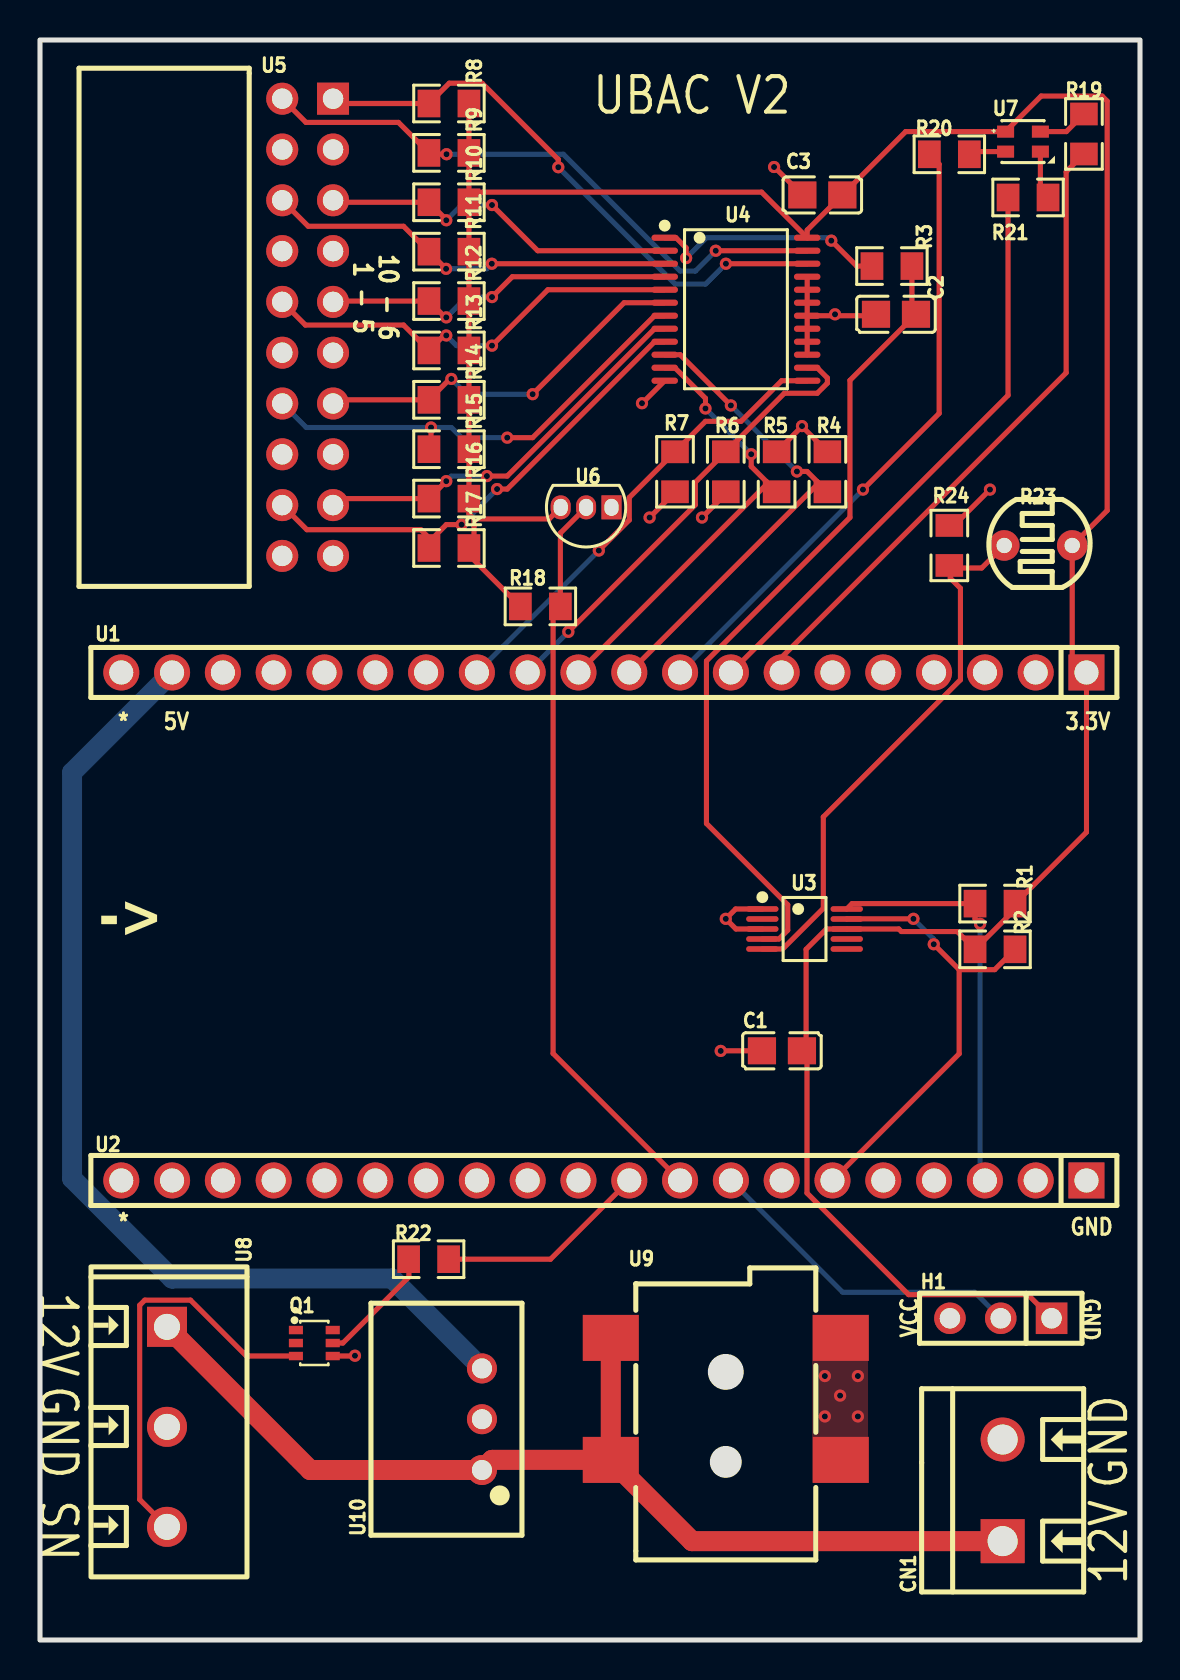
[diagram p4: board, top side]
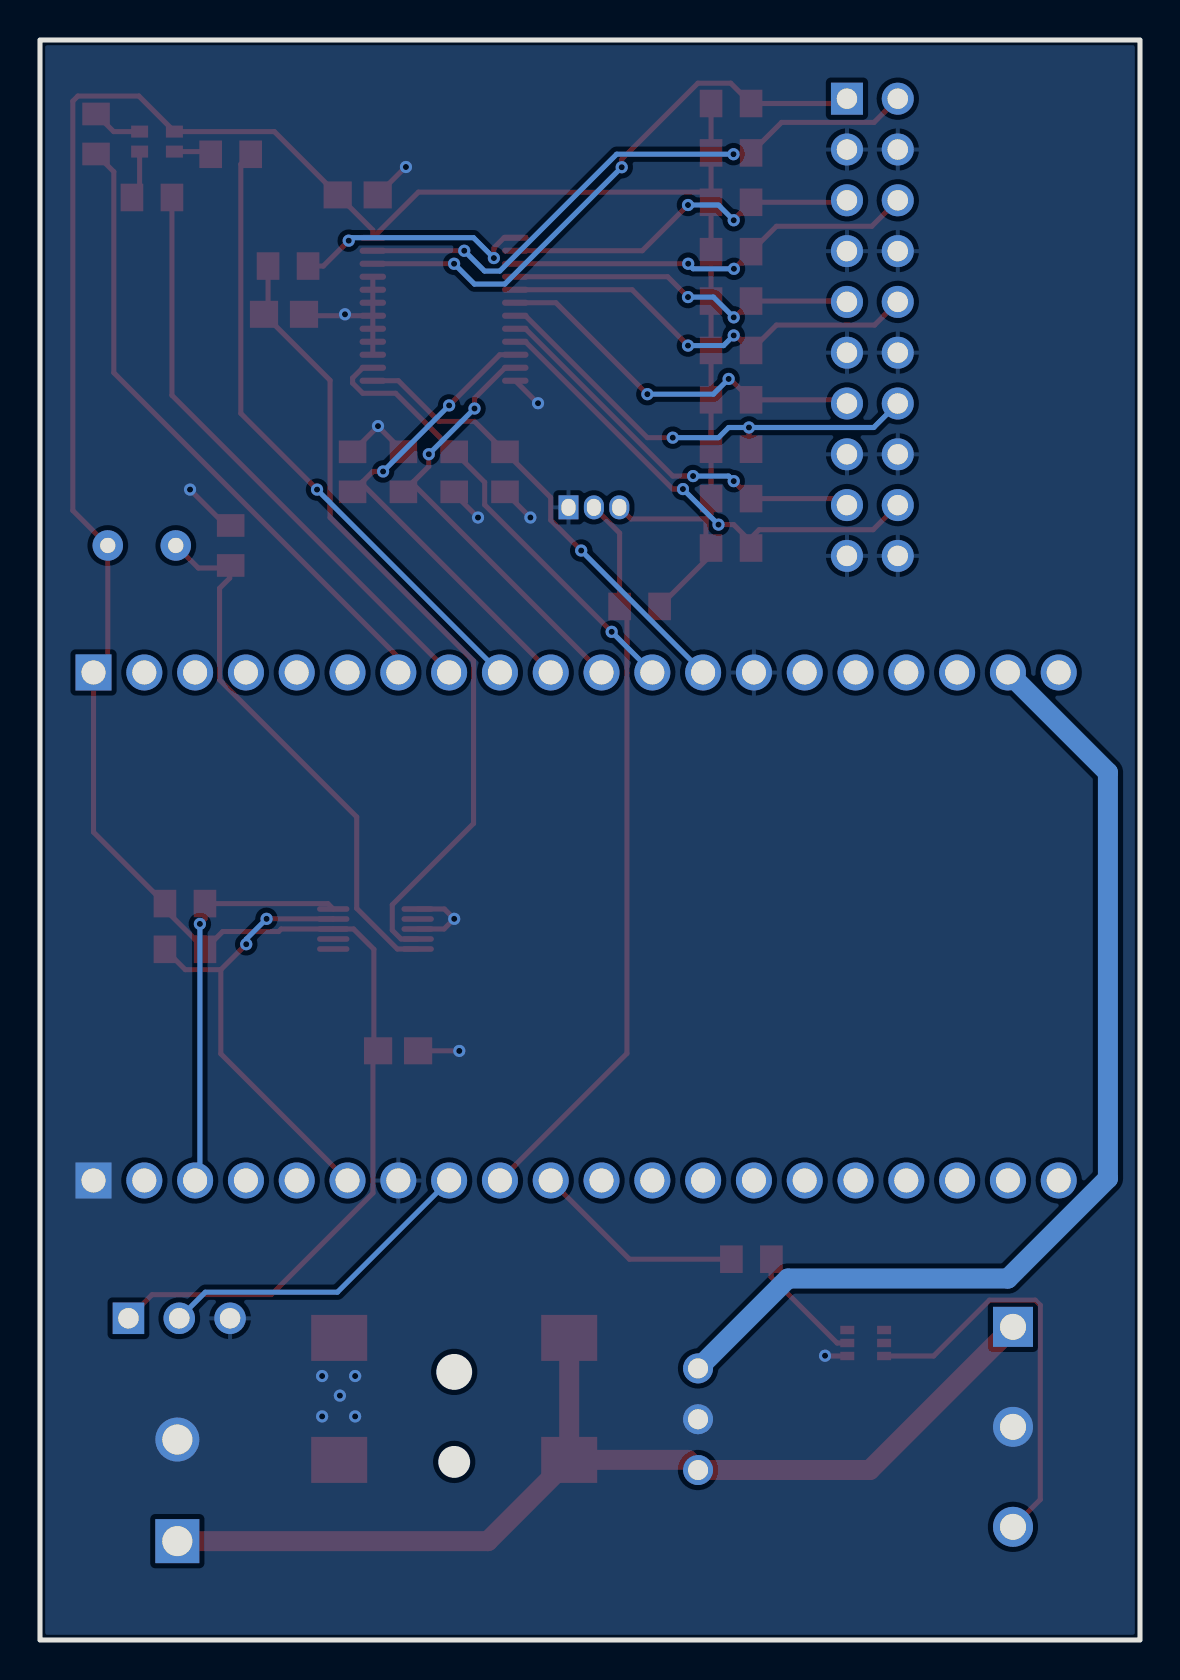
[diagram p5: board, bottom side, seen from below]

Outline 55 x 80 mm; copper layers: Top Layer, Bottom Layer. Coordinates in mm from the lower left corner of the outline.
Outline path: rectangle 0,80 55,0
Stack: Top Layer 0.035mm / Dielectric1 1.51mm FR4 er 4.5 / Bottom Layer 0.035mm

## Design rules (mm)
template: Custom Config
spacing copperThickness1oz (default): track to track 0.102, other pairs 0.152 to 0.3
spacing copperThickness2oz: track to track 0.203, other pairs 0.152 to 0.3
track width copperThickness1oz (default): min 0.127, default 0.254, max 2.54
track width copperThickness2oz: min 0.203, default 0.254, max 2.54
track width copperThickness1ozLarge: min 0.8, default 1, max 2.54
differential pair differentialPair (default): width min 0.127, default 0.254, max 2.54; gap min 0.152, default 0.152
via viaSize (default): diameter min 0.5, default 0.61, max 10; hole min 0.3, default 0.305, max 6.3
net 12V uses copperThickness1ozLarge
net 5V uses copperThickness1ozLarge

## Placement (name value [footprint] x y rotation side)
C1  100nF  [C0805]  37.1 29.46 0 top
C2  1uF  [C0805]  42.8 66.29 0 top
C3  100nF  [C0805]  39.12 72.25 0 top
CN1  1729128  [CONN-TH_2P-P5.08_1729128]  48.13 7.48 90 top
H1  PM254V-11-03-H85  [HDR-TH_3P-P2.54-V-F]  48.04 16.09 180 top
Q1  MBT3904DW1T1G  [SOT-363_L2.0-W1.3-P0.65-LS2.1-TL]  13.72 14.85 0 top
R1  4.7kΩ  [R0805]  47.75 36.82 180 top
R2  4.7kΩ  [R0805]  47.75 34.53 180 top
R3  220Ω  [R0805]  42.6 68.7 180 top
R4  100kΩ  [R0805]  39.37 58.41 90 top
R5  100kΩ  [R0805]  36.83 58.41 90 top
R6  100kΩ  [R0805]  34.29 58.41 90 top
R7  100kΩ  [R0805]  31.75 58.41 90 top
R8  56kΩ  [R0805]  20.45 76.83 180 top
R9  56kΩ  [R0805]  20.45 74.36 180 top
R10  56kΩ  [R0805]  20.45 71.89 180 top
R11  56kΩ  [R0805]  20.45 69.42 180 top
R12  56kΩ  [R0805]  20.45 66.95 180 top
R13  56kΩ  [R0805]  20.45 64.48 180 top
R14  56kΩ  [R0805]  20.45 62.01 180 top
R15  56kΩ  [R0805]  20.45 59.54 180 top
R16  56kΩ  [R0805]  20.45 57.07 180 top
R17  56kΩ  [R0805]  20.45 54.6 180 top
R18  4.7kΩ  [R0805]  25.02 51.68 180 top
R19  100Ω  [R0805]  52.2 75.3 270 top
R20  100Ω  [R0805]  45.47 74.28 0 top
R21  180Ω  [R0805]  49.4 72.13 180 top
R22  1kΩ  [R0805]  19.43 19.04 180 top
R23  GL5539  [RES-TH_L5.1-W4.3-P3.40-D0.5]  49.91 54.73 270 top
R24  10kΩ  [R0805]  45.47 54.73 90 top
U1  ZX-PM2.54-1-20PY  [HDR-TH_20P-P2.54-V-F]  28.19 48.38 180 top
U2  ZX-PM2.54-1-20PY  [HDR-TH_20P-P2.54-V-F]  28.19 22.98 180 top
U3  ADS1115IDGSR  [MSOP-10_L3.0-W3.0-P0.50-LS5.0-BL]  38.23 35.55 270 top
U4  CD74HC4067SM96  [SSOP-24_L8.1-W5.3-P0.65-LS7.8-BL]  34.8 66.54 270 top
U5  HX FH254-02-10-W-H8.5 right angle pin header  [HDR-TH_20P-P2.54-H-F-R2-C10-S2.54-W12.7]  13.38 65.64 270 top
U6  DS18B20  [TO-92-3_L4.5-W3.5-P1.27-L]  27.31 56.63 180 top
U7  XL-B2020RGBA-HF  [LED-SMD_4P-L2.1-W2.1-P1.0-BL]  49.15 74.92 0 top
U8  MX126-5.0-03P-GN01-Cu-S-A  [CONN-TH_3P-P5.00_MAX_MX126-5.0-GN01-03P-CU-S-A]  6.35 10.66 270 top
U9  DC-050-20  [DC-IN-SMD_DC-050-20A]  34.29 12.06 180 top
U10  K7805-1000R3  [PWRM-TH_YLPTEC_K78XX-1000R3]  22.1 11.04 90 top

## Footprints (pads in the part's own frame, mm; a bottom-side part is the same pattern mirrored in y, then rotated)
C0805
  rect 1.41x1.35 smd: 1(-1,0) 2(1,0)
CONN-TH_2P-P5.08_1729128
  rect 2.2x2.2 hole 1.5: 1(-2.54,0)
  round 2.2 hole 1.5: 2(2.54,0)
CONN-TH_3P-P5.00_MAX_MX126-5.0-GN01-03P-CU-S-A
  rect 2x2 hole 1.3: 1(-5,0)
  round 2 hole 1.3: 2(0,0) 3(5,0)
DC-IN-SMD_DC-050-20A
  rect 2.8x2.3 smd: 1(5.75,3.05) 1(5.75,-3.05) 2(-5.75,3.05) 3(-5.75,-3.05)
HDR-TH_3P-P2.54-V-F
  rect 1.575x1.575 hole 1.02: 1(-2.54,0)
  round 1.575 hole 1.02: 2(0,0) 3(2.54,0)
HDR-TH_20P-P2.54-H-F-R2-C10-S2.54-W12.7
  rect 1.6x1.6 hole 1.02: 1(-11.43,1.27)
  round 1.6 hole 1.02: 2(-11.43,-1.27) 3(-8.89,1.27) 4(-8.89,-1.27) 5(-6.35,1.27) 6(-6.35,-1.27) 7(-3.81,1.27) 8(-3.81,-1.27) 9(-1.27,1.27) 10(-1.27,-1.27) 11(1.27,1.27) 12(1.27,-1.27) 13(3.81,1.27) 14(3.81,-1.27) 15(6.35,1.27) 16(6.35,-1.27) 17(8.89,1.27) 18(8.89,-1.27) 19(11.43,1.27) 20(11.43,-1.27)
HDR-TH_20P-P2.54-V-F
  rect 1.8x1.8 hole 1.2: 1(-24.13,0)
  round 1.8 hole 1.2: 2(-21.59,0) 3(-19.05,0) 4(-16.51,0) 5(-13.97,0) 6(-11.43,0) 7(-8.89,0) 8(-6.35,0) 9(-3.81,0) 10(-1.27,0) 11(1.27,0) 12(3.81,0) 13(6.35,0) 14(8.89,0) 15(11.43,0) 16(13.97,0) 17(16.51,0) 18(19.05,0) 19(21.59,0) 20(24.13,0)
LED-SMD_4P-L2.1-W2.1-P1.0-BL
  rect 0.85x0.6 smd: 1(0.87,-0.5) 2(-0.87,-0.5) 3(-0.87,0.5) 4(0.87,0.5)
MSOP-10_L3.0-W3.0-P0.50-LS5.0-BL
  oval 0.28x1.62 smd: 1(-1,-2.11) 2(-0.5,-2.11) 3(0,-2.11) 4(0.5,-2.11) 5(1,-2.11) 6(1,2.11) 7(0.5,2.11) 8(0,2.11) 9(-0.5,2.11) 10(-1,2.11)
PWRM-TH_YLPTEC_K78XX-1000R3
  round 1.5 hole 1: 1(-2.54,0) 2(0,0) 3(2.54,0)
R0805
  rect 1.133x1.377 smd: 1(-1,0) 2(1,0)
RES-TH_L5.1-W4.3-P3.40-D0.5
  round 1.524 hole 0.762: 1(0,1.7) 2(0,-1.7)
SOT-363_L2.0-W1.3-P0.65-LS2.1-TL
  rect 0.7x0.42 smd: 1(-0.92,0.65) 2(-0.92,0) 3(-0.92,-0.65) 4(0.92,-0.65) 5(0.92,0) 6(0.92,0.65)
SSOP-24_L8.1-W5.3-P0.65-LS7.8-BL
  oval 0.308x1.324 smd: 1(-3.575,-3.562) 2(-2.925,-3.562) 3(-2.275,-3.562) 4(-1.625,-3.562) 5(-0.975,-3.562) 6(-0.325,-3.562) 7(0.325,-3.562) 8(0.975,-3.562) 9(1.625,-3.562) 10(2.275,-3.562) 11(2.925,-3.562) 12(3.575,-3.562) 13(3.575,3.562) 14(2.925,3.562) 15(2.275,3.562) 16(1.625,3.562) 17(0.975,3.562) 18(0.325,3.562) 19(-0.325,3.562) 20(-0.975,3.562) 21(-1.625,3.562) 22(-2.275,3.562) 23(-2.925,3.562) 24(-3.575,3.562)
TO-92-3_L4.5-W3.5-P1.27-L
  rect 1x1.2 hole 0.7x0.85: 1(-1.27,0)
  oval 1x1.2 hole 0.7x0.85: 2(0,0) 3(1.27,0)

## Nets
As in the schematic.

Pads without a net: Q1 1 2 6; U1 2 3 4 5 6 15 16 17 18 20; U2 2 4 5 11 12 13 14 15 16 17 18 19 20; U3 2 6 7

## Via types
v1: diameter 0.61, hole 0.305, Top Layer to Bottom Layer, 47 vias

## Routing (per net, layer and track width the routed paths; a pad name or vN(x,y) marks a point on that pad's centre or on a via; arc(x,y) is an arc through that point)
5V: length 51.8
  Bottom Layer w1: 22.1,13.58 17.6,18.07 6.6,18.07 1.6,23.07 1.6,43.38 U1.19
12V: length 52.7
  Top Layer w1: U9.1 28.54,15.1 ; U9.1 32.6,4.94 CN1.1 ; U9.1 22.6,9 U10.1 13.51,8.5 U8.1
GND: length 28.2
  Top Layer w0.254: 38.36,64.26 U4.16 U4.17 U4.18 ; v1(30.1,61.84) 30.11,61.84 U4.12 ; v1(47.5,57.52) 45.7,55.73 R24.2 ; C1.1 34.04,29.46 v1(34.04,29.45) ; 38.1,60.68 v1(38.1,60.7) ; 38.1,60.68 R4.2 ; 38.1,60.68 R5.2 ; U4.18 U4.19 U4.20 U4.21 ; U4.18 41.73,66.21 C2.1 ; C3.1 36.72,73.65 v1(36.7,73.65) ; U3.1 34.78,36.55 v1(34.29,36.06) 34.8,35.55 U3.3 ; R6.1 34.29,57.31 v1(33.1,56.12) ; 14.64,14.2 15.75,14.2 v1(15.75,14.21) ; v1(30.48,56.12) 31.75,57.39 R7.1
  vias: v1(39.24,13.2) v1(39.24,11.18) v1(39.75,66.28) v1(40,12.22) v1(40.89,13.2) v1(40.89,11.18)
VCC: length 149.4
  Top Layer w0.254: R18.2 21.45,54.25 R17.1 21.7,54.85 21.7,56.05 ; 21.45,72.14 R10.1 R11.1 R12.1 R13.1 R14.1 R15.1 R16.1 21.45,56.31 21.7,56.05 ; 21.45,72.14 21.7,72.39 36.08,72.39 U4.24 38.36,70.5 C3.2 43.28,75.42 U7.3 50.06,77.2 53.1,77.2 53.36,76.94 53.36,56.47 R23.1 51.61,49.09 U1.1 52.32,40.39 R1.1 48.75,36.53 R2.2 45.86,35.42 43.07,35.42 42.94,35.55 39.32,35.55 38.31,34.53 38.31,29.67 C1.2 38.35,29.21 38.35,22.35 43.43,17.27 49.4,17.27 H1.1 ; 21.45,72.14 R9.1 R8.1 ; 21.7,56.05 25.46,56.05 U6.3
DH11_DATA: length 16.3
  Bottom Layer w0.254: H1.2 46.73,17.39 40.13,17.39 U2.8
DS18B20_DATA: length 37
  Top Layer w0.254: U6.2 26.02,55.35 R18.1 25.65,51.31 25.65,29.33 U2.9
FAN_CTRL: length 10.7
  Top Layer w0.254: U2.10 25.53,19.04 R22.1
LDR: length 27.3
  Top Layer w0.254: 45.51,53.6 45.51,53.09 46.02,52.58 46.02,48.01 39.16,41.15 39.16,36.58 37.13,34.55 U3.5 ; 45.51,53.6 R24.1 ; 45.51,53.6 47.08,53.6 R23.2
LED_B: length 31.5
  Top Layer w0.254: v1(41.15,57.52) 44.96,61.33 44.96,73.79 R20.1
  Bottom Layer w0.254: U1.9 v1(41.15,57.52)
LED_G: length 32.2
  Top Layer w0.254: R19.2 51.31,73.41 51.31,63.36 37.08,49.14 U1.7
LED_R: length 29.5
  Top Layer w0.254: R21.2 48.4,62.24 U1.8
MUX_SELECT_0: length 24.4
  Top Layer w0.254: R4.1 38.86,57.92 ; 38.86,57.92 38.86,57.78 U1.10 ; 38.86,57.92 38.35,58.43 v1(37.85,58.43) ; 31.24,64.26 32.01,64.26 v1(34.54,61.73)
  Bottom Layer w0.254: v1(37.85,58.43) v1(34.54,61.73)
MUX_SELECT_1: length 22.2
  Top Layer w0.254: v1(35.56,59.29) 35.56,58.68 36.32,57.92 ; U1.11 36.32,57.78 36.32,57.92 ; R5.1 36.32,57.92 ; v1(33.27,61.58) 33.27,62.08 31.75,63.61 31.24,63.61
  Bottom Layer w0.254: v1(35.56,59.29) v1(33.27,61.58)
MUX_SELECT_2: length 23.1
  Top Layer w0.254: U4.14 38.86,63.61 39.37,63.1 39.37,62.84 38.86,62.34 37.22,62.34 R6.2 32.77,57.89 32.77,56.76 v1(26.42,50.41)
  Bottom Layer w0.254: v1(26.42,50.41) U1.12
MUX_SELECT_3: length 23.2
  Top Layer w0.254: v1(27.94,54.47) 29.46,56 29.46,57.12 R7.2 33.27,60.93 35.05,60.93 37.08,62.96 U4.13
  Bottom Layer w0.254: v1(27.94,54.47) U1.13
NTC_ADC: length 40.8
  Top Layer w0.254: R3.1 43.6,66.49 C2.2 40.5,62.98 40.5,56.13 33.32,48.95 33.32,40.82 37.39,36.76 37.39,35.49 36.95,35.05 U3.4
NTC_MUX: length 12.1
  Top Layer w0.254: U4.1 31.8,70.11 32.31,69.61 v1(32.31,69.1) ; R3.2 40.83,68.7 v1(39.56,69.97)
  Bottom Layer w0.254: v1(39.56,69.97) 39.42,70.11 33.32,70.11 v1(32.31,69.1)
SCL: length 20.6
  Top Layer w0.254: v1(47.01,35.8) 46.75,36.06 R1.2 40.61,36.82 40.34,36.55
  Bottom Layer w0.254: U2.3 47.01,23.22 v1(47.01,35.8)
SDA: length 23.2
  Top Layer w0.254: R2.1 47.74,33.52 45.96,33.52 ; v1(43.67,36.06) 40.34,36.06 40.34,36.05 ; 45.96,33.52 v1(44.69,34.79) ; 45.96,33.52 45.96,29.31 U2.6
  Bottom Layer w0.254: v1(43.67,36.06) 44.69,35.04 v1(44.69,34.79)
TEMP1: length 30.2
  Top Layer w0.254: U4.23 v1(33.79,69.46) ; U5.2 13.3,75.88 17.92,75.88 R9.2 19.51,74.29 v1(20.33,74.29)
  Bottom Layer w0.254: v1(33.79,69.46) 32.77,68.45 32.01,68.45 26.17,74.29 v1(20.33,74.29)
TEMP2: length 20.6
  Top Layer w0.254: U5.6 13.41,70.69 18.18,70.69 R11.2 v1(20.3,68.56) ; v1(22.59,68.81) U4.3
  Bottom Layer w0.254: v1(22.59,68.81) 22.34,68.56 v1(20.3,68.56)
TEMP3: length 21.8
  Top Layer w0.254: v1(22.6,64.72) 25.39,67.51 U4.5 ; U5.10 13.27,65.75 18.18,65.75 R13.2 20.2,65.23 v1(20.31,65.23)
  Bottom Layer w0.254: v1(20.31,65.23) 20.82,64.72 v1(22.6,64.72)
TEMP4: length 23.5
  Top Layer w0.254: U4.7 30.73,66.21 24.63,60.12 v1(23.36,60.12) ; v1(19.55,60.62) 19.55,59.64 R15.2
  Bottom Layer w0.254: v1(23.36,60.12) 21.08,60.12 20.57,60.62 v1(19.55,60.62) 13.31,60.62 U5.14
TEMP5: length 24.4
  Top Layer w0.254: 19.55,55.01 19.55,54.7 R17.2 ; 19.55,55.01 19.04,55.52 13.34,55.52 U5.18 ; 19.55,55.01 20.31,55.77 v1(21.08,55.77) ; v1(22.85,57.55) 23.36,57.55 30.73,64.91 U4.9
  Bottom Layer w0.254: v1(22.85,57.55) v1(21.08,55.77)
TEMP6: length 20.2
  Top Layer w0.254: v1(20.31,57.94) R16.2 14.98,57.07 U5.17 ; v1(22.35,58.2) 23.36,58.2 30.73,65.56 U4.8
  Bottom Layer w0.254: v1(22.35,58.2) 20.57,58.2 v1(20.31,57.94)
TEMP7: length 19.3
  Top Layer w0.254: v1(24.63,62.29) 29.2,66.86 U4.6 ; U5.13 14.84,62.01 R14.2 20.49,63.05 v1(20.57,63.05)
  Bottom Layer w0.254: v1(24.63,62.29) 21.33,62.29 v1(20.57,63.05)
TEMP8: length 17.8
  Top Layer w0.254: U4.4 23.62,68.16 v1(22.6,67.15) ; v1(20.31,66.13) 20.26,66.13 R12.2 14.69,66.95 U5.9
  Bottom Layer w0.254: v1(22.6,67.15) 21.33,67.15 v1(20.31,66.13)
TEMP9: length 18.3
  Top Layer w0.254: U4.2 24.89,69.46 v1(22.6,71.75) ; U5.5 14.75,71.89 R10.2 20.31,71.02 v1(20.31,70.99)
  Bottom Layer w0.254: v1(20.31,70.99) 21.08,71.75 v1(22.6,71.75)
TEMP10: length 29
  Top Layer w0.254: U4.22 v1(34.3,68.81) ; U5.1 14.89,76.83 R8.2 20.46,77.84 22.1,77.84 25.91,74.03 v1(25.91,73.64)
  Bottom Layer w0.254: v1(34.3,68.81) 33.28,67.8 31.76,67.8 v1(25.91,73.64)
$3N394: length 20.7
  Top Layer w0.254: U8.3 4.98,7.02 4.98,16.74 5.24,16.99 7.53,16.99 10.32,14.2 12.8,14.2
$3N812: length 6.1
  Top Layer w0.254: R22.2 18.45,19.03 18.45,18.15 15.14,14.85 Q1.5
$6N1989: length 2.5
  Top Layer w0.254: R19.1 51.32,75.42 U7.4
$6N2479: length 2.5
  Top Layer w0.254: R21.1 50.02,72.51 U7.1
$6N2851: length 1.9
  Top Layer w0.254: U7.2 46.6,74.42 R20.2

## Copper pours and planes (outline as drawn; the poured copper is in the pictures)
GND on Top Layer: 38.61,16.25 41.4,16.25 41.4,7.86 38.61,7.86
GND on Bottom Layer: 0,80 55,80 55,0 0,0

## Text on the board
Top Silkscreen Layer: VCC | GND | * | 5V | 3.3V | 1 - 5 | 10 - 6 | 12V | SN | UBAC V2 | ->
